# EasyEDA Pro project ProPrj_Quadcopter_2024-12-10.epro, board Quadcopter2.4
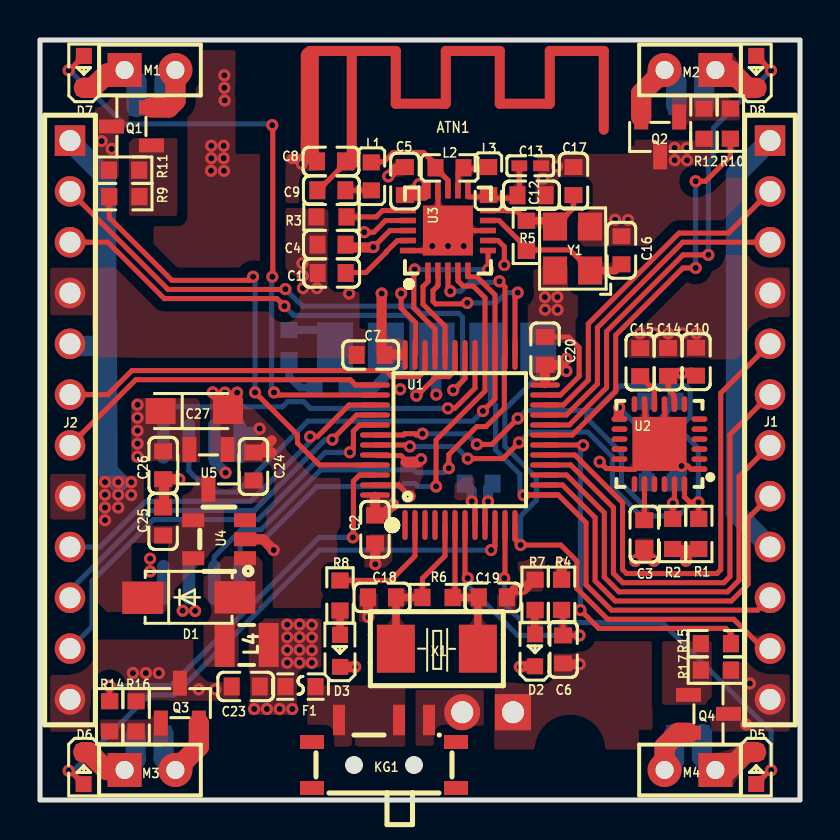
[diagram p5: board, top side]
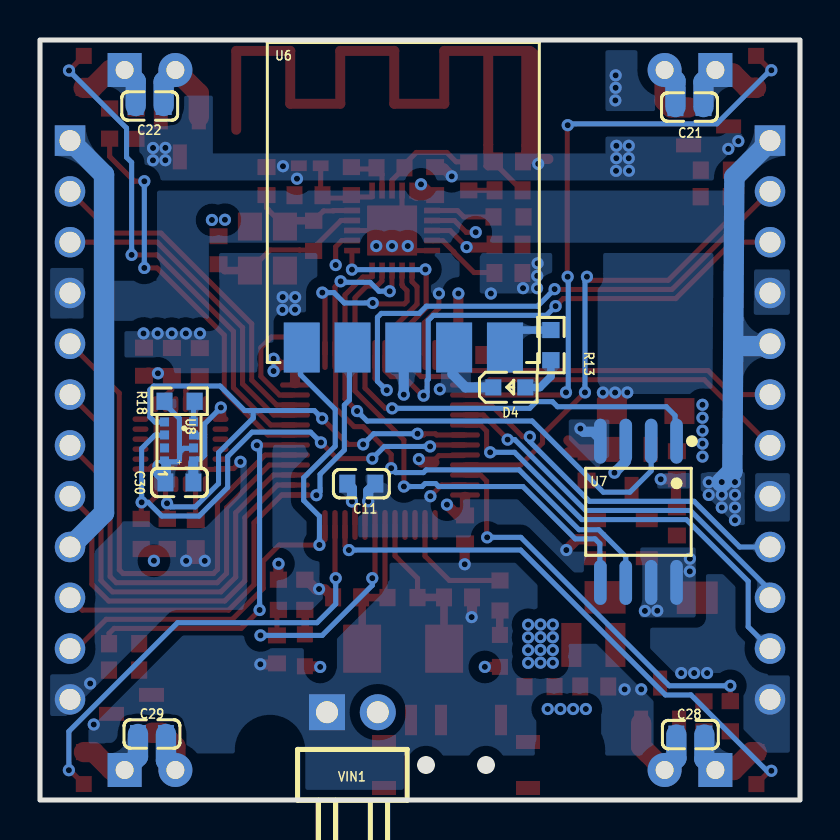
[diagram p6: board, bottom side, seen from below]

Outline 38 x 38 mm; copper layers: Top Layer, GND, VCC, Bottom Layer. Coordinates in mm from the lower left corner of the outline.
Outline path: rectangle 0,38 38,0
Stack: Top Layer 0.035mm 外层铜厚1oz / Dielectric1 0.2104mm 7628 RC49% 8.6mil / GND 0.0152mm 内层铜厚 / Dielectric2 1.065mm 1.1mm H/HOZ Copper / VCC 0.0152mm 内层铜厚 / Dielectric3 0.2104mm 7628 RC49% 8.6mil / Bottom Layer 0.035mm 外层铜厚1oz

## Design rules (mm)
template: 自定义配置
spacing copperThickness1oz (default): track to track 0.203, other pairs 0.203 to 0.203
spacing copperThickness2oz: track to track 0.203, other pairs 0.152 to 0.3
track width copperThickness1oz (default): min 0.254, default 0.254, max 0.762
track width copperThickness2oz: min 0.203, default 0.254, max 2.54
track width VCC GND: min 0.254, default 0.508, max 1.016
differential pair differentialPair (default): width min 0.127, default 0.254, max 2.54; gap min 0.152, default 0.152
via viaSize (default): diameter min 0.5, default 0.61, max 10; hole min 0.3, default 0.305, max 6.299
net GND uses VCC GND
net 3.3V uses VCC GND
net VBAT uses VCC GND
net $1N91 uses VCC GND
net $1N90 uses VCC GND
net 5V uses VCC GND
net $1N88 uses VCC GND
net $1N89 uses VCC GND

## Placement (name value [footprint] x y rotation side)
C1  33nF  [C0603]  14.58 26.35 0 top
C2  100nF  [C0603]  16.75 13.53 270 top
C3  2.2nF  [C0603]  30.21 13.29 270 top
C4  4.7uF  [C0603]  14.58 27.77 0 top
C5  100nF  [C0603]  18.24 30.95 270 top
C6  100nF  [C0603]  26.15 7.53 270 top
C7  100nF  [C0603]  16.53 22.25 180 top
C8  1pF  [C0603]  14.55 31.93 180 top
C9  1.5pF  [C0603]  14.57 30.49 0 top
C10  100nF  [C0603]  32.8 21.91 90 top
C11  100nF  [C0603]  21.93 15.82 0 bottom
C12  22pF  [C0603]  24.57 30.24 0 top
C13  4.7pF  [C0402]  24.51 31.71 0 top
C14  10nF  [C0603]  31.4 21.9 270 top
C15  100nF  [C0603]  30.01 21.89 270 top
C16  22pF  [C0603]  29.07 27.49 270 top
C17  22pF  [C0603]  26.67 30.95 90 top
C18  22pF  [C0603]  17.1 10.13 180 top
C19  22pF  [C0603]  22.64 10.13 180 top
C20  100nF  [C0603]  25.25 22.45 270 top
C21  100nF  [C0603]  5.53 34.65 180 bottom
C22  100nF  [C0603]  32.52 34.7 0 bottom
C23  2.2uF  [C0603]  10.29 5.68 0 top
C24  22uF  [C0603]  10.67 16.68 270 top
C25  1uF  [C0603]  6.15 13.92 270 top
C26  1uF  [C0603]  6.16 16.74 90 top
C27  47uF  [CAP-SMD_L3.2-W1.6-RD]  7.72 19.45 0 top
C28  100nF  [C0603]  5.48 3.27 180 bottom
C29  100nF  [C0603]  32.4 3.3 0 bottom
C30  100nF  [C0603]  31.03 15.88 0 bottom
D1  SS54  [SMA_L4.3-W2.6-LS5.0-FD]  7.44 10.12 180 top
D2  NCD0603G1  [LED0603-RD]  24.76 7.48 90 top
D3  NCD0603G1  [LED0603-RD]  15 7.45 90 top
D4  NCD0603G1  [LED0603-RD]  14.53 20.63 180 bottom
D5  NCD0603R1  [LED0603-RD_RED]  35.81 1.6 270 top
D6  NCD0603R1  [LED0603-RD_RED]  2.18 1.59 270 top
D7  NCD0603R1  [LED0603-RD_RED]  2.2 36.4 90 top
D8  NCD0603R1  [LED0603-RD_RED]  35.82 36.41 90 top
F1  BSMD0603-050-6V  [F0603]  13.02 5.67 180 top
J1  HB-PH3-254112PB2GOP  [HDR-TH_12P-P2.54-V-M]  36.5 19 270 top
J2  HB-PH3-254112PB2GOP  [HDR-TH_12P-P2.54-V-M]  1.5 19 270 top
KG1  MSK12C02  [SW-TH_MSK12C02]  17.2 2.3 0 top
L1  3.9nH  [L0603]  16.56 31.18 270 top
L2  8.2nH  [L0603]  20.47 31.61 180 top
L3  2.7nH  [L0603]  22.43 30.94 90 top
L4  2.2uH  [IND-SMD_L2.5-W2.0_MHCHL2520]  10.33 7.75 180 top
M1  720  [HDR2.54-LI-2P]  5.5 36.5 0 top
M2  720  [HDR2.54-LI-2P]  32.5 36.5 180 top
M3  720  [HDR2.54-LI-2P]  5.5 1.5 0 top
M4  720  [HDR2.54-LI-2P]  32.5 1.5 180 top
NOREF  -  [Pad_e568]  13.49 32.55 0 top
NOREF#2  -  [Pad_e571]  15.59 32.55 0 top
Q1  SI2302  [SOT-23-3_L2.9-W1.3-P1.90-LS2.4-BR]  4.57 33.68 0 top
Q2  SI2302  [SOT-23-3_L2.9-W1.3-P1.90-LS2.4-BR]  31.01 33.15 90 top
Q3  SI2302  [SOT-23-3_L2.9-W1.3-P1.90-LS2.4-BR]  6.99 4.84 270 top
Q4  SI2302  [SOT-23-3_L2.9-W1.3-P1.90-LS2.4-BR]  33.43 4.31 180 top
R1  10kΩ  [R0603]  32.94 13.3 270 top
R2  10kΩ  [R0603]  31.63 13.3 270 top
R3  22kΩ  [R0603]  14.57 29.15 180 top
R4  10kΩ  [R0603]  26.08 10.26 90 top
R5  1MΩ  [R0603]  24.32 28.21 90 top
R6  1MΩ  [R0603]  19.88 10.12 0 top
R7  1kΩ  [R0603]  24.76 10.26 270 top
R8  1kΩ  [R0603]  15 10.22 270 top
R9  1kΩ  [R0603]  4.22 30.17 180 top
R10  1kΩ  [R0603]  34.52 33.82 270 top
R11  10kΩ  [R0603]  4.21 31.49 0 top
R12  10kΩ  [R0603]  33.2 33.81 90 top
R13  1kΩ  [R0603]  12.46 22.75 270 bottom
R14  1kΩ  [R0603]  3.48 4.19 90 top
R15  1kΩ  [R0603]  33.8 7.82 0 top
R16  10kΩ  [R0603]  4.8 4.18 270 top
R17  10kΩ  [R0603]  33.8 6.49 180 top
R18  10kΩ  [R0603]  31.02 19.94 180 bottom
U1  STM32F103C8T6  [LQFP-48_L7.0-W7.0-P0.50-LS9.0-BL]  21 18 0 top
U2  MPU-6050  [QFN-24_L4.0-W4.0-P0.50-BL-EP2.7]  30.93 17.85 180 top
U3  NRF24L01P-R  [QFN-20_L4.0-W4.0-P0.50-BL-EP]  20.4 28.47 0 top
U4  TPS613222ADBVR  [TSOT-23-5_L2.9-W1.6-P0.95-LS2.8-BR]  8.95 13.04 0 top
U5  662K  [SOT-23-3_L2.9-W1.3-P1.90-LS2.4-BR]  8.42 16.53 90 top
U6  VG6328A  [COMM-SMD_VG6328A]  19.82 22.62 180 bottom
U7  W25Q32JVSSIQ  [SOIC-8_L5.3-W5.3-P1.27-LS8.0-BL]  8.08 14.41 0 bottom
U8  SPL06-001  [SENSOR-SMD_SPL06-001]  31.05 17.93 270 bottom
VIN1  PZ254R-11-02P  [HDR-TH_2P-P2.54-H-M-W10.4]  22.38 4.39 180 bottom
X1  8MHz  [CRYSTAL-SMD_L5.0-W3.2]  19.84 7.56 0 top
Y1  16MHz  [OSC-SMD_4P-L3.2-W2.5-BL]  26.63 27.57 90 top

## Footprints (pads in the part's own frame, mm; a bottom-side part is the same pattern mirrored in y, then rotated)
C0402
  rect 0.79x0.54 smd: 1(-0.545,0) 2(0.545,0)
C0603
  rect 0.8x0.9 smd: 1(-0.7,0) 2(0.7,0)
CAP-SMD_L3.2-W1.6-RD
  rect 1.5x1.296 smd: 1(-1.687,0) 2(1.687,0)
COMM-SMD_VG6328A
  rect 1.8x2.5 smd: 1(-5.09,0.01) 2(-2.55,0.01) 3(-0.01,0.01) 4(2.53,0.01) 5(5.07,0.01)
CRYSTAL-SMD_L5.0-W3.2
  rect 1.9x2.4 smd: 1(-2.05,0) 2(2.05,0)
F0603
  rect 0.806x0.864 smd: 1(-0.753,0) 2(0.753,0)
HDR2.54-LI-2P
  rect 1.7x1.7 hole 0.9: 1(-1.27,0)
  round 1.7 hole 0.9: 2(1.27,0)
HDR-TH_2P-P2.54-H-M-W10.4
  rect 1.8x1.8 hole 1.1: 1(-1.27,0)
  round 1.8 hole 1.1: 2(1.27,0)
HDR-TH_12P-P2.54-V-M
  rect 1.524x1.524 hole 1.05: 1(-13.97,0)
  round 1.524 hole 1.05: 2(-11.43,0) 3(-8.89,0) 4(-6.35,0) 5(-3.81,0) 6(-1.27,0) 7(1.27,0) 8(3.81,0) 9(6.35,0) 10(8.89,0) 11(11.43,0) 12(13.97,0)
IND-SMD_L2.5-W2.0_MHCHL2520
  rect 1x2.2 smd: 1(-1.1,0) 2(1.1,0)
L0603
  rect 0.8x0.864 smd: 1(-0.7,0) 2(0.7,0)
LED0603-RD
  rect 0.8x0.8 smd: 1(-0.799,0) 2(0.799,0)
LED0603-RD_RED
  rect 0.8x0.8 smd: 1(-0.799,-0.004) 2(0.799,0.004)
LQFP-48_L7.0-W7.0-P0.50-LS9.0-BL
  oval 0.27x1.5 smd: 1(-2.75,-4.25) 2(-2.25,-4.25) 3(-1.75,-4.25) 4(-1.25,-4.25) 5(-0.75,-4.25) 6(-0.25,-4.25) 7(0.25,-4.25) 8(0.75,-4.25) 9(1.25,-4.25) 10(1.75,-4.25) 11(2.25,-4.25) 12(2.75,-4.25) 25(2.75,4.25) 26(2.25,4.25) 27(1.75,4.25) 28(1.25,4.25) 29(0.75,4.25) 30(0.25,4.25) 31(-0.25,4.25) 32(-0.75,4.25) 33(-1.25,4.25) 34(-1.75,4.25) 35(-2.25,4.25) 36(-2.75,4.25)
  oval 1.5x0.27 smd: 13(4.25,-2.75) 14(4.25,-2.25) 15(4.25,-1.75) 16(4.25,-1.25) 17(4.25,-0.75) 18(4.25,-0.25) 19(4.25,0.25) 20(4.25,0.75) 21(4.25,1.25) 22(4.25,1.75) 23(4.25,2.25) 24(4.25,2.75) 37(-4.25,2.75) 38(-4.25,2.25) 39(-4.25,1.75) 40(-4.25,1.25) 41(-4.25,0.75) 42(-4.25,0.25) 43(-4.25,-0.25) 44(-4.25,-0.75) 45(-4.25,-1.25) 46(-4.25,-1.75) 47(-4.25,-2.25) 48(-4.25,-2.75)
OSC-SMD_4P-L3.2-W2.5-BL
  rect 1.4x1.2 smd: 1(-1.1,-0.875) 2(1.1,-0.875) 3(1.1,0.875) 4(-1.1,0.875)
Pad_e568
  rect 0.9x0.5 smd: 2(0,0)
Pad_e571
  rect 0.5x0.5 smd: 1(0,0)
QFN-20_L4.0-W4.0-P0.50-BL-EP
  rect 0.28x0.8 smd: 1(-1,-2) 2(-0.5,-2) 3(0,-2) 4(0.5,-2) 5(1,-2) 11(1,2) 12(0.5,2) 13(0,2) 14(-0.5,2) 15(-1,2)
  rect 0.8x0.28 smd: 6(2,-1) 7(2,-0.5) 8(2,0) 9(2,0.5) 10(2,1) 16(-2,1) 17(-2,0.5) 18(-2,0) 19(-2,-0.5) 20(-2,-1)
  rect 2.5x2.5 smd: 21(0,0)
QFN-24_L4.0-W4.0-P0.50-BL-EP2.7
  rect 2.7x2.7 smd: (-0.044,0.044)
  oval 0.8x0.28 smd: 1(-2.045,1.307) 2(-2.045,0.807) 3(-2.045,0.307) 4(-2.045,-0.193) 5(-2.045,-0.693) 6(-2.045,-1.193) 13(1.956,-1.193) 14(1.956,-0.693) 15(1.956,-0.193) 16(1.956,0.307) 17(1.956,0.807) 18(1.956,1.299)
  oval 0.28x0.8 smd: 7(-1.294,-1.943) 8(-0.794,-1.943) 9(-0.294,-1.943) 10(0.205,-1.943) 11(0.706,-1.943) 12(1.206,-1.943) 19(1.206,2.057) 20(0.706,2.057) 21(0.205,2.057) 22(-0.294,2.057) 23(-0.794,2.057) 24(-1.294,2.057)
R0603
  rect 0.806x0.864 smd: 1(-0.753,0) 2(0.753,0)
SENSOR-SMD_SPL06-001
  rect 0.45x0.45 smd: 1(0.975,-0.725) 2(0.325,-0.725) 3(-0.325,-0.725) 4(-0.975,-0.725) 5(-0.975,0.725) 6(-0.325,0.725) 7(0.325,0.725) 8(0.975,0.725)
SMA_L4.3-W2.6-LS5.0-FD
  rect 2.046x1.62 smd: 1(-2.304,-0.009) 2(2.304,0.009)
SOIC-8_L5.3-W5.3-P1.27-LS8.0-BL
  oval 0.63x2.25 smd: 1(-1.905,-3.53) 2(-0.635,-3.53) 3(0.635,-3.53) 4(1.905,-3.53) 5(1.905,3.53) 6(0.635,3.53) 7(-0.635,3.53) 8(-1.905,3.53)
SOT-23-3_L2.9-W1.3-P1.90-LS2.4-BR
  rect 1.25x0.7 smd: 1(1,-0.95) 2(1,0.95) 3(-1,0)
SW-TH_MSK12C02
  rect 1.2x0.7 smd: (-3.6,0.6) (-3.6,-1.7) (3.6,0.6) (3.6,-1.7)
  rect 0.6x1.524 smd: 1(-2.25,1.7) 2(0.75,1.7) 3(2.25,1.7)
TSOT-23-5_L2.9-W1.6-P0.95-LS2.8-BR
  rect 1.1x0.7 smd: 1(1.294,-0.951) 2(1.294,-0.001) 3(1.294,0.951) 4(-1.294,0.951) 5(-1.294,-0.949)

## Nets
As in the schematic, except:
5V: C24.2 C25.2 D1.2 J1.1 J1.9 J2.1 J2.5 U4.4 U4.5 U5.3
GND: C1.1 C2.2 C3.2 C4.1 C5.1 C6.2 C7.2 C8.2 C10.2 C11.1 C12.2 C13.2 C14.1 C15.1 C16.1 C17.2 C18.2 C19.1 C20.1 C23.1 C24.1 C25.1 C26.1 C27.2 C30.2 J1.4 J1.12 J2.4 J2.8 J2.12 NOREF.2 Q1.3 Q2.3 Q3.3 Q4.3 R3.2 R7.1 R11.1 R12.1 R16.1 R17.1 R18.1 U1.8 U1.23 U1.35 U1.44 U1.47 U2. U2.1 U2.9 U2.11 U2.18 U3.8 U3.14 U3.17 U3.20 U3.21 U4.2 U5.1 U6.3 U7.4 U8.1 U8.7 VIN1.1 Y1.2 Y1.4
$1N83: C8.1 C9.1 NOREF#2.1
$1N71135: F1.1 KG1.1 KG1.2

Pads without a net: U1 1 3 4; U2 2 3 4 5 6 7 12 14 15 16 17 19 21 22; U4 3; U8 2

## Via types
v1: diameter 0.61, hole 0.305, Top Layer to Bottom Layer, 162 vias

## Routing (per net, layer and track width the routed paths; a pad name or vN(x,y) marks a point on that pad's centre or on a via; arc(x,y) is an arc through that point)
3.3V: length 36.3
  Top Layer w0.254: U1.9 22.25,14.77 v1(22.4,14.93) ; v1(16.67,27.65) 17.49,28.47 18.45,28.47 ; 22.4,27.97 22.91,27.97 23.22,27.66 v1(23.22,26.75) ; 31.41,21.18 31.41,20.53 31.69,20.25 31.69,19.87 31.75,19.82
  Top Layer w0.508: 32.27,11.92 32.29,11.94 32.29,12.48 ; 26.1,10.99 26.08,11.01 26.08,11.77 26.12,11.81 ; v1(16.67,27.65) 16.65,27.63 15.41,27.63 15.21,27.83 ; v1(17.65,14.77) 17.12,14.23 C2.1 16.75,14.23 16.75,15.16 ; 26.01,21.75 v1(26.32,21.45) ; 28.95,19.17 28.94,19.18 28.94,19.61 ; 17.3,22.28 18.1,22.28 ; 18.39,30.22 19.21,30.22 19.24,30.26 19.24,30.36 ; 18.39,30.22 18.94,30.77 ; 18.39,30.22 18.35,30.18 18.31,30.22 ; 32.25,21.37 32.23,21.35 31.25,21.35 ; v1(17.08,25.32) 17.08,22.4 C7.1 ; 18.93,30.76 19.2,30.49 19.25,30.49 ; 32.56,21.37 32.64,21.3 ; 31.64,12.6 31.74,12.49 32.9,12.49 32.9,12.49 ; 32.64,21.21 32.69,21.21 ; D3.1 15.76,6.65 ; 24.78,6.61 24.71,6.68 24.07,6.68 ; v1(26.32,22.06) 26.01,21.75 C20.2 25.25,20.84
  Bottom Layer w0.254: 30.24,18.28 30.21,18.25 ; 30.21,18.25 30.11,18.16 29.77,18.16 29.77,17.24 29.96,17.05 30.14,17.05 30.32,16.87 ; 30.21,18.25 30.32,18.25 ; 30.21,18.25 29.77,18.25 29.77,18.8 28.96,19.61
  Bottom Layer w0.508: C11.2 22.4,15.59 v1(22.4,14.93) ; v1(9.28,16.36) 8.72,16.92 8.72,17.44 ; D4.1 16.72,20.63 17.37,21.28 17.37,22.73 17.36,22.75 ; 30.31,15.99 30.34,16.02 30.34,16.86
  vias: v1(4.88,19.76) v1(4.88,19.11) v1(4.88,18.47) v1(4.88,17.82) v1(4.88,17.17) v1(5.51,12.07) v1(5.51,11.43) v1(7.14,9.46) v1(7.75,9.45) v1(15.76,6.66) v1(18.01,20.53) v1(18.95,30.78) v1(23.99,6.65) v1(26.07,11.81) v1(28.96,19.62) v1(32.1,21.33) v1(32.3,11.96)
5V: length 41.7
  Bottom Layer w1.016: J1.1 34.8,31.27 34.8,14.35 J1.9 ; 3.28,22.7 1.51,22.7 ; 3.91,15.9 3.38,16.43 3.28,31.14 1.4,33.03 1.4,33.05
  vias: v1(3.25,15.9) v1(3.25,15.26) v1(3.25,14.62) v1(3.25,13.99) v1(3.91,15.9) v1(3.91,15.26) v1(3.91,14.62) v1(4.56,15.89) v1(4.56,15.25)
GND: length 56.8
  Top Layer w0.254: v1(32.08,16.7) 32.39,16.7 32.55,16.54 33.1,16.54 33.1,16.54 ; 31.09,18.48 31.24,18.62 31.24,19.78 ; 25.22,23.23 25.3,23.15 26.43,23.15 26.96,22.62 26.96,21.18 26.02,20.25 25.36,20.25 ; 28.88,16.53 29.74,16.53 30.4,17.19 ; 30.24,19.82 30.24,18.93 30.16,18.85 ; 27.98,16.91 28.32,16.57 28.87,16.57 ; 22.4,28.47 21.19,28.47 ; v1(21.59,14.94) 21.75,14.77 U1.8 ; v1(19.06,17.04) 18.23,17.04 18.06,17.22 16.82,17.22 ; v1(16.21,28.39) 16.22,28.38 16.69,28.38 17.28,28.97 18.4,28.97 18.41,28.97 ; 19.9,30.47 19.9,28.97 20.4,28.47 ; 18.4,27.47 19.39,27.47 v1(19.61,27.7) ; v1(18.48,15.19) 17.92,15.75 16.74,15.75 ; 28.9,16.54 28.89,16.55 ; U1.35 18.78,22.28 18.78,23.86 18.06,24.59 v1(18.06,25.32)
  Top Layer w0.508: 9.4,19.61 9.4,20.21 v1(9.25,20.37) ; 9.4,19.61 v1(8.64,20.38) ; 9.4,19.61 C27.2 9.85,19.9 v1(9.85,20.37) ; 26.18,6.77 26.19,6.78 26.99,6.78 ; C18.2 16.4,9.16 v1(16.42,9.14) ; 6.14,14.53 6.2,14.6 6.2,16.04 ; 23.4,10.18 23.75,10.53 24.19,10.53 24.7,11.04 ; v1(11.68,12.5) 11.14,13.04 U4.2 ; 19.04,17 18.91,16.88 18.28,16.88 ; C2.2 16.76,12.82 v1(16.76,11.79) ; 18.09,31.57 17.81,31.57 v1(17.41,31.18) ; 10.97,17.38 11.58,17.38 11.58,17.37 ; 10.97,17.38 C24.1 ; 10.97,17.38 11.58,17.98 ; 6.2,16.04 6.2,16.07 ; 6.2,16.04 6.19,16.04 6.16,16.07 ; 6.2,16.04 6.97,16.04 ; 13.7,32.4 13.44,32.66 ; 13.7,31.81 13.74,31.81 ; 12.58,32.05 13.68,32.05 13.7,32.03 ; v1(30.69,11.96) 30.6,12.05 29.83,12.05 29.77,11.99
  Bottom Layer w0.254: 31.65,19.99 31.65,19.7 31.03,19.07 31.03,17.4 ; 30.34,17.58 30.34,17.58 30.82,17.58 31.03,17.38 31.03,17.02 31.13,16.91 31.81,16.91
  Bottom Layer w0.508: v1(19.81,20.27) 19.81,22.6 U6.3 ; C11.1 21.59,15.46 v1(21.59,14.94) ; 10.03,18.1 10.34,18.41 10.82,18.41 v1(10.98,18.57) ; v1(32.08,16.7) 32.08,16.32 31.7,15.94 ; 31.76,16.9 31.7,16.84 31.7,15.94 ; 31.69,15.93 31.7,15.94 ; 31.7,15.94 31.7,15.87
  vias: v1(3.08,32.95) v1(3.58,32.56) v1(4.65,6.35) v1(5.29,6.35) v1(5.94,6.35) v1(6.96,16.04) v1(7.94,5.53) v1(8.56,32.71) v1(8.56,32.09) v1(8.55,31.46) v1(8.77,5.53) v1(9.22,36.23) v1(9.22,35.61) v1(9.23,34.98) v1(9.18,32.71) v1(9.18,32.09) v1(9.2,31.46) v1(13.09,31.81) v1(13.12,26.83) v1(13.14,26.21) v1(13.15,25.59) v1(13.85,25.59) v1(15.46,25.32) v1(20.4,27.7) v1(21.19,27.7) v1(24.05,10.55) v1(25.15,31.06) v1(25.24,25.14) v1(25.25,24.52) v1(25.85,31.69) v1(25.87,25.15) v1(25.88,24.51) v1(26.98,6.79) v1(27.98,16.91) v1(28.75,29.01) v1(29.4,29) v1(29.76,11.96) v1(30,23.33) v1(30.71,23.33) v1(31.41,23.33) v1(31.73,32.61) v1(31.73,31.99) v1(32.12,23.33) v1(32.35,32.6) v1(32.35,31.98) v1(32.82,23.33) v1(35.31,3.77) v1(35.49,5.83)
VBAT: length 17.9
  Top Layer w0.762: 4.38,1.49 4.43,1.49
  Top Layer w1.016: D5.1 35.31,2.4 34.42,1.5 M4.1 ; 35.82,35.61 35.38,35.61 34.49,36.5 M2.1 ; M1.1 4.05,36.32 3.35,36.32 2.64,35.61 2.21,35.61 D7.1 ; M3.1 3.33,1.5 2.44,2.39 2.18,2.39 D6.1
  Bottom Layer w1.016: M3.1 4.78,2.05 C28.2 ; M2.1 33.22,35.95 C22.2 ; M4.1 33.1,2.17 C29.2 ; C21.2 4.83,35.9 M1.1
  vias: v1(10.71,4.55) v1(11.34,4.55) v1(11.98,4.55) v1(12.36,8.77) v1(12.36,8.13) v1(12.36,7.5) v1(12.36,6.86) v1(12.61,4.55) v1(12.98,8.77) v1(12.98,8.14) v1(12.98,7.5) v1(12.98,6.87) v1(13.59,8.76) v1(13.59,8.13) v1(13.59,7.49) v1(13.59,6.86)
CE: length 4.5
  Top Layer w0.254: 19.4,26.15 19.4,25.92 19.15,25.67 19.15,24.79 20.25,23.69 U1.32
CS1: length 8.9
  Top Layer w0.254: v1(23.88,25.37) 23.75,25.23 U1.25 ; 19.9,26.15 19.9,25.78 19.88,25.75 19.88,25.7 19.65,25.47 19.65,24.94 19.78,24.8 21.28,24.8 21.28,24.8
  Bottom Layer w0.254: v1(23.88,25.37) 23.3,25.37 22.78,24.85 v1(21.36,24.85)
CS2: length 19.3
  Top Layer w0.254: U1.29 21.75,20.6 20.74,19.58 v1(20.4,19.58)
  Bottom Layer w0.254: v1(20.4,19.58) 13.52,19.58 13.18,19.92 12.38,19.92 12.12,19.66 6.69,19.66 6.25,19.23 6.25,18.02 U7.1
LED1: length 30.8
  Top Layer w0.254: v1(11.7,20.38) 11.83,20.25 U1.38 ; v1(1.43,36.49) 1.48,36.49 D7.2 ; 11.64,26.18 11.64,33.6 11.53,33.7
  Bottom Layer w0.254: 11.59,26.1 11.59,20.49 v1(11.7,20.38) ; v1(11.61,33.74) 11.55,33.81 4.16,33.81 1.45,36.52
  vias: v1(11.62,26.16)
LED2: length 24.9
  Top Layer w0.254: v1(36.55,36.47) 35.82,37.2 D8.2 ; v1(33.42,27.25) 32.15,27.25 28.33,23.43 28.33,20.62 26.46,18.75 U1.20
  Bottom Layer w0.254: v1(33.42,27.25) 33.42,31.88 33.67,32.14 33.67,33.6 v1(36.55,36.47)
LED3: length 28.1
  Top Layer w0.254: v1(22.56,12.5) 22.75,12.69 U1.10 ; v1(1.43,1.46) 1.51,1.46 D6.2
  Bottom Layer w0.254: v1(1.43,1.46) 1.66,1.46 5.45,5.25 6.73,5.25 13.97,12.5 v1(22.56,12.5)
LED4: length 22.9
  Top Layer w0.254: v1(36.56,1.49) 36.5,1.49 35.81,0.8 ; U1.11 23.25,11.13 v1(23.22,11.09)
  Bottom Layer w0.254: v1(36.56,1.49) 36.56,3.43 31.12,8.86 24.15,8.86 23.22,9.8 v1(23.22,11.09)
MISO: length 26.1
  Top Layer w0.254: 21.4,26.15 21.85,26.15 22.75,25.26 U1.27 22.75,20.05 v1(22.15,19.45)
  Bottom Layer w0.254: v1(22.15,19.45) 21.65,18.95 13.39,18.95 9.84,15.39 8.51,15.39 7.44,16.46 U7.2
MOSI: length 25.4
  Top Layer w0.254: 20.9,26.15 20.9,25.95 21.16,25.7 21.66,25.7 22.25,25.11 U1.28 22.25,20.45 19.81,18 v1(19.81,15.67)
  Bottom Layer w0.254: v1(19.81,15.67) 18.89,15.67 18.74,15.82 18.22,15.82 18.07,15.67 13.85,15.67 11.24,13.06 10.25,13.06 10.01,12.82 10.01,10.91 U7.5
NRF_IRQ: length 9.4
  Top Layer w0.254: v1(22.4,26.52) 22.4,27.47 22.4,27.47 ; U1.33 19.75,23.54 18.69,24.6 18.69,26.49 v1(18.73,26.53)
  Bottom Layer w0.254: v1(22.4,26.52) 18.74,26.52 v1(18.73,26.53)
OSC_IN: length 8
  Top Layer w0.254: U1.5 20.25,12.21 19.12,11.08 R6.1
  Top Layer w0.381: X1.1 17.8,7.57 C18.1 19.12,10.13 R6.1
OSC_OUT: length 7.6
  Top Layer w0.254: R6.2 20.75,10.24 U1.6
  Top Layer w0.381: 21.93,10.12 21.89,10.08 X1.2 ; 21.93,10.12 C19.2 ; 21.93,10.12 R6.2
PA4: length 19.6
  Top Layer w0.254: J1.8 35.41,14.1 35.41,10.79 34.57,9.95 28.76,9.95 27.76,10.95 27.76,14.11 26.12,15.75 U1.14
PA5: length 21.6
  Top Layer w0.254: J1.7 34.95,16.18 34.95,10.98 34.38,10.41 28.95,10.41 28.21,11.14 28.21,14.36 26.33,16.25 U1.15
PA6: length 23.7
  Top Layer w0.254: U1.16 26.54,16.75 28.67,14.61 28.67,11.33 29.14,10.86 34.19,10.86 34.49,11.17 34.49,18.26 J1.6
PA7: length 25.6
  Top Layer w0.254: U1.17 26.74,17.25 29.13,14.86 29.13,11.52 29.33,11.32 33.84,11.32 34.04,11.51 34.04,20.35 J1.5
PB3: length 18.3
  Top Layer w0.254: U1.39 15.45,19.75 13.87,18.17 v1(13.51,18.17)
  Bottom Layer w0.254: J2.9 3.01,12.65 5.3,14.94 10.53,14.94 13.51,17.91 v1(13.51,18.17)
PB4: length 19.3
  Top Layer w0.254: v1(14.62,18.02) 14.62,18.04 15.83,19.25 U1.40
  Bottom Layer w0.254: v1(14.62,18.02) 14.26,18.02 10.72,14.48 5.49,14.48 1.5,10.49 J2.10
PB5: length 21.7
  Top Layer w0.254: v1(15.49,17.39) 15.67,17.56 15.67,18.44 15.98,18.75 U1.41
  Bottom Layer w0.254: J2.11 2.59,8.66 2.59,10.94 5.68,14.02 10.91,14.02 14.27,17.39 v1(15.49,17.39)
PC13: length 5.8
  Top Layer w0.254: R8.1 17.53,10.98 18.75,12.2 U1.2
PWM1: length 23.2
  Top Layer w0.254: v1(10.75,20.38) 12.87,18.26 12.87,17.85 13.97,16.75 U1.45 ; v1(10.65,26.16) 10.48,25.98 6.59,25.98 3.46,29.11 R9.2
  Bottom Layer w0.254: v1(10.75,20.38) 10.75,26.06 v1(10.65,26.16)
PWM2: length 20.1
  Top Layer w0.254: R10.2 34.52,32.18 33.28,30.94 v1(32.78,30.94) ; v1(32.78,26.6) 32.15,26.6 28.79,23.24 28.79,20.43 26.61,18.25 U1.19
  Bottom Layer w0.254: v1(32.78,26.6) v1(32.78,30.94)
PWM3: length 20
  Top Layer w0.254: R14.2 v1(3.48,5.71) ; U1.46 15.98,16.25 15.67,15.94 15.67,13.16 v1(15.64,13.13)
  Bottom Layer w0.254: v1(3.48,5.71) 6.54,5.71 13.96,13.13 v1(15.64,13.13)
PWM4: length 18.7
  Top Layer w0.254: R15.2 34.55,8.33 34.29,8.58 27.94,8.58 v1(27.02,9.5) ; 25.25,17.75 27.14,17.75 v1(27.16,17.74)
  Bottom Layer w0.254: v1(27.02,9.5) 27.02,17.6 v1(27.16,17.74)
RST: length 11.8
  Top Layer w0.254: U1.7 21.25,11.23 v1(21.38,11.09) ; v1(26.97,8.23) C6.1 26.15,9.43 26.08,9.51
  Bottom Layer w0.254: v1(21.38,11.09) 21.38,10.73 23.89,8.23 v1(26.97,8.23)
RXD1: length 25.8
  Top Layer w0.254: J2.3 3.39,27.89 6.21,25.07 11.84,25.07 v1(12.22,24.69) ; U1.31 20.75,21.48 20.44,21.17 19.81,21.17 18.86,20.22 v1(18.82,20.22)
  Bottom Layer w0.254: v1(18.82,20.22) 18.64,20.4 18.64,20.98 18.59,21.04 18.59,23.98 18.33,24.23 12.68,24.23 v1(12.22,24.69)
RXD2: length 25
  Top Layer w0.254: v1(24.18,15.24) 24.19,15.25 U1.13 25.91,15.25 27.3,13.86 27.3,10.77 28.57,9.49 35.88,9.49 J1.10
  Bottom Layer w0.254: v1(24.18,15.24) 24,15.42 24,16.29 22.78,17.5 22.78,19.75 22.53,20 22.53,22.66 22.44,22.75
RXD3: length 17.3
  Top Layer w0.254: J1.2 34.42,28.35 31.95,28.35 27.41,23.81 27.41,20.99 26.17,19.75 U1.22
SCK: length 29.3
  Top Layer w0.254: v1(22.97,25.93) 23.25,25.65 U1.26 23.22,22.22 23.22,19.59 22.3,18.67 21.83,18.67 20.44,17.27 v1(20.44,16.59) ; 20.4,26.15 20.4,25.5 20.46,25.44 v1(20.52,25.44)
  Bottom Layer w0.254: v1(22.97,25.93) 22.92,25.88 21.5,25.88 21.05,25.44 v1(20.52,25.44) ; v1(20.44,16.59) 20.22,16.37 18.83,16.37 18.69,16.51 14.04,16.51 11.05,13.51 10.06,13.51 8.71,12.17 U7.6
SCL: length 28.8
  Top Layer w0.254: R2.1 31.65,14.07 v1(31.65,14.83) 31.72,14.91 U2.23 ; v1(23.89,19.08) 22.59,17.78 v1(21.84,17.78) ; v1(19.12,18.31) 19.06,18.25 18.82,18.25 18.76,18.31 18.23,18.31 18.17,18.25 U1.42
  Bottom Layer w0.254: v1(23.89,19.08) 24.29,19.47 27.34,19.47 ; v1(21.84,17.78) 21.31,18.31 v1(19.12,18.31) ; 31.66,14.85 31.47,14.66 30.24,14.66 29.07,15.82 29.07,17.36 27.34,19.1 27.34,19.47 ; 27.34,19.47 27.77,19.47 28.99,20.7 32.31,20.7 32.51,20.51 32.51,19.15 32.25,18.9 31.78,18.9 U8.4
SDA: length 26.3
  Top Layer w0.254: U1.43 18.42,17.75 v1(18.5,17.68) ; R1.1 32.94,14.87 v1(32.92,14.88) 32.5,14.88 32.22,15.16 U2.24 ; v1(21.39,17.07) 23.15,17.07 v1(23.95,17.88)
  Bottom Layer w0.254: v1(23.95,17.88) 24.47,18.39 27.4,18.39 28.62,17.17 28.62,15.63 30.05,14.2 31.91,14.2 32.6,14.88 v1(32.92,14.88) 32.92,17.58 32.26,18.24 31.79,18.24 U8.3 ; v1(21.39,17.07) 20.78,17.68 v1(18.5,17.68)
SWCLK: length 16.7
  Top Layer w0.254: J2.7 4.78,21.01 15.51,21.01 15.78,20.75 U1.37
SWDIO: length 19.3
  Top Layer w0.254: U1.34 19.25,21.48 18.94,21.17 17.6,21.17 17.3,21.47 4.59,21.47 3.39,20.27 J2.6
TXD1: length 28.1
  Top Layer w0.254: U1.30 21.25,21.08 v1(20.66,20.49) ; v1(12.27,25.54) 12.25,25.53 6.4,25.53 J2.2
  Bottom Layer w0.254: v1(12.27,25.54) 13.12,24.69 18.68,24.69 19.04,24.33 20.93,24.33 21.13,24.14 21.13,20.93 20.68,20.49 v1(20.66,20.49)
TXD2: length 28.2
  Top Layer w0.254: U1.12 23.75,13.03 v1(24.03,12.75) 24.03,12.75 26.04,12.75 26.84,11.94 26.84,10.58 28.38,9.04 34.69,9.04 36.16,7.57 J1.11
  Bottom Layer w0.254: v1(24.03,12.75) 24.03,14.19 24.82,14.98 24.82,16.11 23.24,17.69 23.24,19.53 24.98,21.27 24.98,22.75
TXD3: length 16.5
  Top Layer w0.254: J1.3 32.14,27.89 27.87,23.62 27.87,20.81 26.32,19.25 U1.21
$1N42: length 1.7
  Top Layer w0.254: 30.71,19.78 30.71,20.47 30.03,21.16 29.99,21.16
$1N81: length 3.2
  Top Layer w0.254: 18.4,29.47 17.13,29.47 16.81,29.15 R3.1
$1N82: length 3.8
  Top Layer w0.254: C1.2 15.3,26.37 16.29,26.37 17.31,27.38 17.31,27.41 17.86,27.96 18.37,27.96 18.38,27.97 18.4,27.97
$1N83: length 3
  Top Layer w0.254: 15.7,32.45 15.7,31.69 15.61,31.61 ; 15.2,31.89 15.2,31.77 13.79,30.36
$1N85: length 8
  Top Layer w0.254: Y1.1 27.5,26.49 26.49,27.5 25.02,27.5 25.01,27.5 24.36,27.5 ; R5.1 24.33,27.47 24.33,27.6 22.95,28.98 22.41,28.98 22.4,28.97 ; 24.3,27.38 24.26,27.34
  Top Layer w0.381: C16.2 28.76,26.47 Y1.1
$1N86: length 5.6
  Top Layer w0.254: Y1.3 26.57,29.49 26.57,29.51 26.67,29.61 C17.1 ; R5.2 23.82,29.46 23.34,29.46 23.32,29.47 22.4,29.47
  Top Layer w0.381: Y1.3 25.46,28.96 R5.2
$1N88: length 4.8
  Top Layer w1.016: M3.2 7.94,2.67 Q3.2
  Bottom Layer w1.016: C28.1 6.18,2.09 M3.2
$1N89: length 4.7
  Top Layer w1.016: M4.2 31.23,2.68 31.91,3.36 Q4.2
  Bottom Layer w1.016: M4.2 31.7,1.97 C29.1
$1N90: length 4.9
  Top Layer w1.016: M2.2 30.06,35.33 Q2.2
  Bottom Layer w1.016: C22.1 31.82,35.91 M2.2
$1N91: length 5
  Top Layer w1.016: Q1.2 6.43,34.63 6.77,34.96 M1.2
  Bottom Layer w1.016: 6.23,34.65 6.23,35.96 M1.2
$1N122: length 5.2
  Top Layer w0.254: 16.56,31.91 17.19,31.91 17.66,32.38 19.19,32.38 19.65,31.91 19.65,31.54 ; L2.2 20.4,30.99 20.4,30.47
$1N123: length 2.7
  Top Layer w0.254: 22.47,31.49 22.41,31.55 21.17,31.55 ; 21.17,31.55 L2.1 ; 21.17,31.55 21.14,31.55 ; 20.9,30.47 20.9,31.31 21.14,31.55 ; 21.14,31.55 21.07,31.55
$1N124: length 4.1
  Top Layer w0.254: C13.1 23.97,30.33 C12.1 23.73,30.09 22.47,30.09 22.41,30.15 21.4,30.15
$1N1536: length 1.8
  Top Layer w0.254: U2.20 30.22,14 C3.1
$1N1557: length 1.3
  Top Layer w0.254: C9.2 16.56,30.49 L1.2
$1N24218: length 1.1
  Top Layer w0.381: 24.74,8.34 24.74,9.43
$1N24219: length 1.2
  Top Layer w0.381: D3.2 15.01,8.26 15.01,9.48
$1N25042: length 1.1
  Bottom Layer w0.254: R18.2 30.32,19.88 U8.5
$1N25237: length 2.7
  Bottom Layer w0.381: R13.1 14.07,23.5 14.82,22.75
$1N71016: length 2.3
  Bottom Layer w0.381: R13.2 12.46,21.17 13,20.62 13.73,20.62 D4.2

## Copper pours and planes (outline as drawn; the poured copper is in the pictures)
3.3V on Top Layer: 4.55,20.09 8,20.09 8,16.88 4.55,16.88
3.3V on Top Layer: 16.33,15.26 17.74,15.26 17.74,13.8 16.33,13.8
3.3V on Top Layer: 16.78,21.76 16.78,23.08 18.43,23.08 18.43,21.76
3.3V on Top Layer: 24.59,22.34 26.58,22.34 26.58,20.6 24.59,20.6
3.3V on Bottom Layer: 16.46,22.05 18.24,22.05 18.24,20.37 16.46,20.37
3.3V on Bottom Layer: 5.21,12.63 7.99,12.63 7.99,9.13 5.21,9.13
3.3V on VCC: 3.28,32.41 35.09,32.41 35.09,6.07 3.28,6.07
5V on Top Layer: 11.2,16.22 11.2,14.96 11.09,14.96 8.48,12.34 8.48,12.28 6.72,10.51 6.72,9.16 6.25,8.69 4.06,8.69 2.79,9.96 2.79,16.02 3,16.22
5V on Bottom Layer: 2.81,30.47 32.21,30.47 32.21,27.86 2.81,27.86
5V on Bottom Layer: 2.75,16.4 4.96,16.4 4.96,13.44 2.75,13.44
5V on Bottom Layer: 29.54,25.96 35.03,25.96 35.03,23.96 29.54,23.96
5V on Bottom Layer: 29.56,30.43 32.18,30.43 32.18,24 29.56,24
GND on Top Layer: 12.83,29.61 16.52,29.61 16.52,25.26 12.83,25.26
GND on Top Layer: 8.38,20.73 11.86,20.73 11.86,16.89 8.38,16.89
GND on Top Layer: 29.35,23.48 33.71,23.48 33.71,22 29.35,22
GND on Top Layer: 26.9,29.4 29.91,29.4 29.91,27.54 26.9,27.54
GND on Top Layer: 4.32,6.65 10.01,6.65 10.01,4.88 4.32,4.88
GND on Top Layer: 12.84,25.82 16.15,25.82 16.15,21.81 12.84,21.81
GND on Top Layer: 33.78,6.4 37.24,6.4 37.24,3.47 33.78,3.47
GND on Top Layer: 2.55,34.06 4.03,34.06 4.03,31 2.55,31
GND on Top Layer: 0,38 38,38 38,0 0,0
GND on Top Layer: 24.78,26.5 26.4,26.5 26.4,22.73 24.78,22.73
GND on Top Layer: 30.61,32.96 33.62,32.96 33.62,31.63 30.61,31.63
GND on Top Layer: 24.75,32.09 27.1,32.09 27.1,29.81 24.75,29.81
GND on Bottom Layer: 0,38 38,38 38,0 0,0
GND on GND: 0.26,37.74 37.74,37.74 37.74,0.26 0.26,0.26
VBAT on Top Layer: 10.44,9.08 14.06,9.08 14.06,4.25 10.44,4.25
VBAT on VCC: 0.26,37.74 37.74,37.74 37.74,0.26 0.26,0.26
$1N1531 on Top Layer: 4.44,33.1 6.87,33.1 6.87,29.2 4.44,29.2
$1N1588 on Top Layer: 31.59,33.49 31.59,35.3 35,35.3 35,33.49
$1N1589 on Top Layer: 2.98,2.67 2.98,4.48 6.4,4.48 6.4,2.67
$1N1590 on Top Layer: 31.1,8.78 33.59,8.78 33.59,4.76 31.1,4.76
$1N45485 on Top Layer: 9.24,12.19 11.12,12.19 11.12,9.73 9.96,8.57 9.96,6.61 9.74,6.39 8.59,6.39 8.18,6.8 8.18,11.13
$1N71133 on Top Layer: 18.78,5.5 22.2,5.5 22.2,2.42 18.78,2.42
$1N71135 on Top Layer: 13.36,5.73 18.28,5.73 18.28,2.66 13.36,2.66

Small or netless copper shapes (teardrops, artwork), in the pictures only: 256 on Top Layer, 92 on Bottom Layer

## Text on the board
Top Silkscreen Layer: ATN1
